# EAGLE design ALM (EAGLE 5.07)
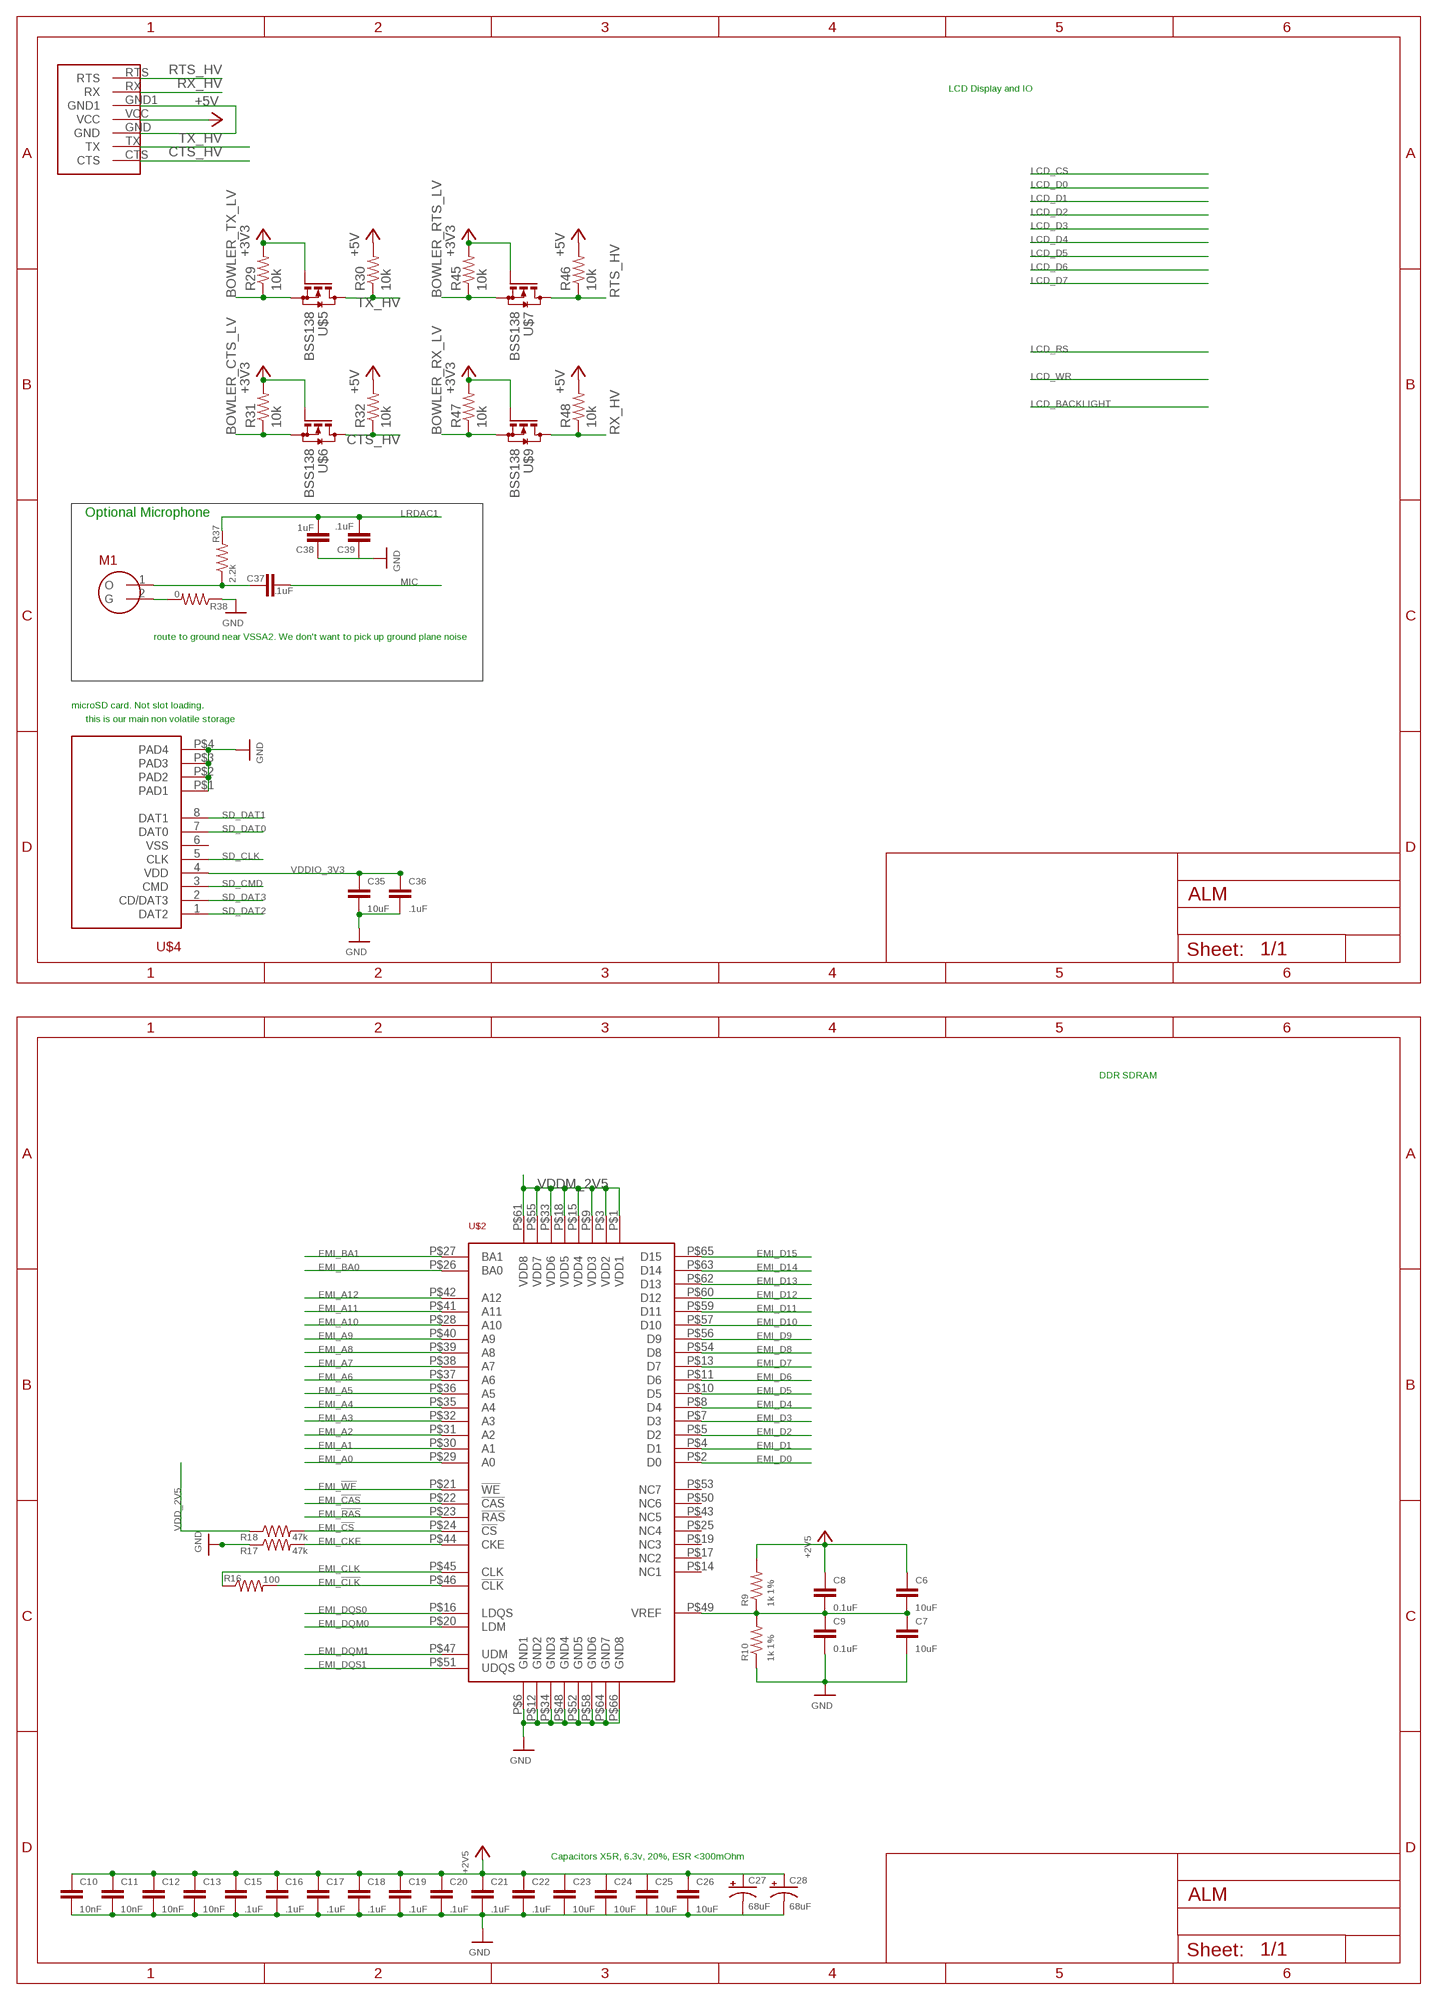
[diagram p0: schematic, sheet 1, part 1 of 3]
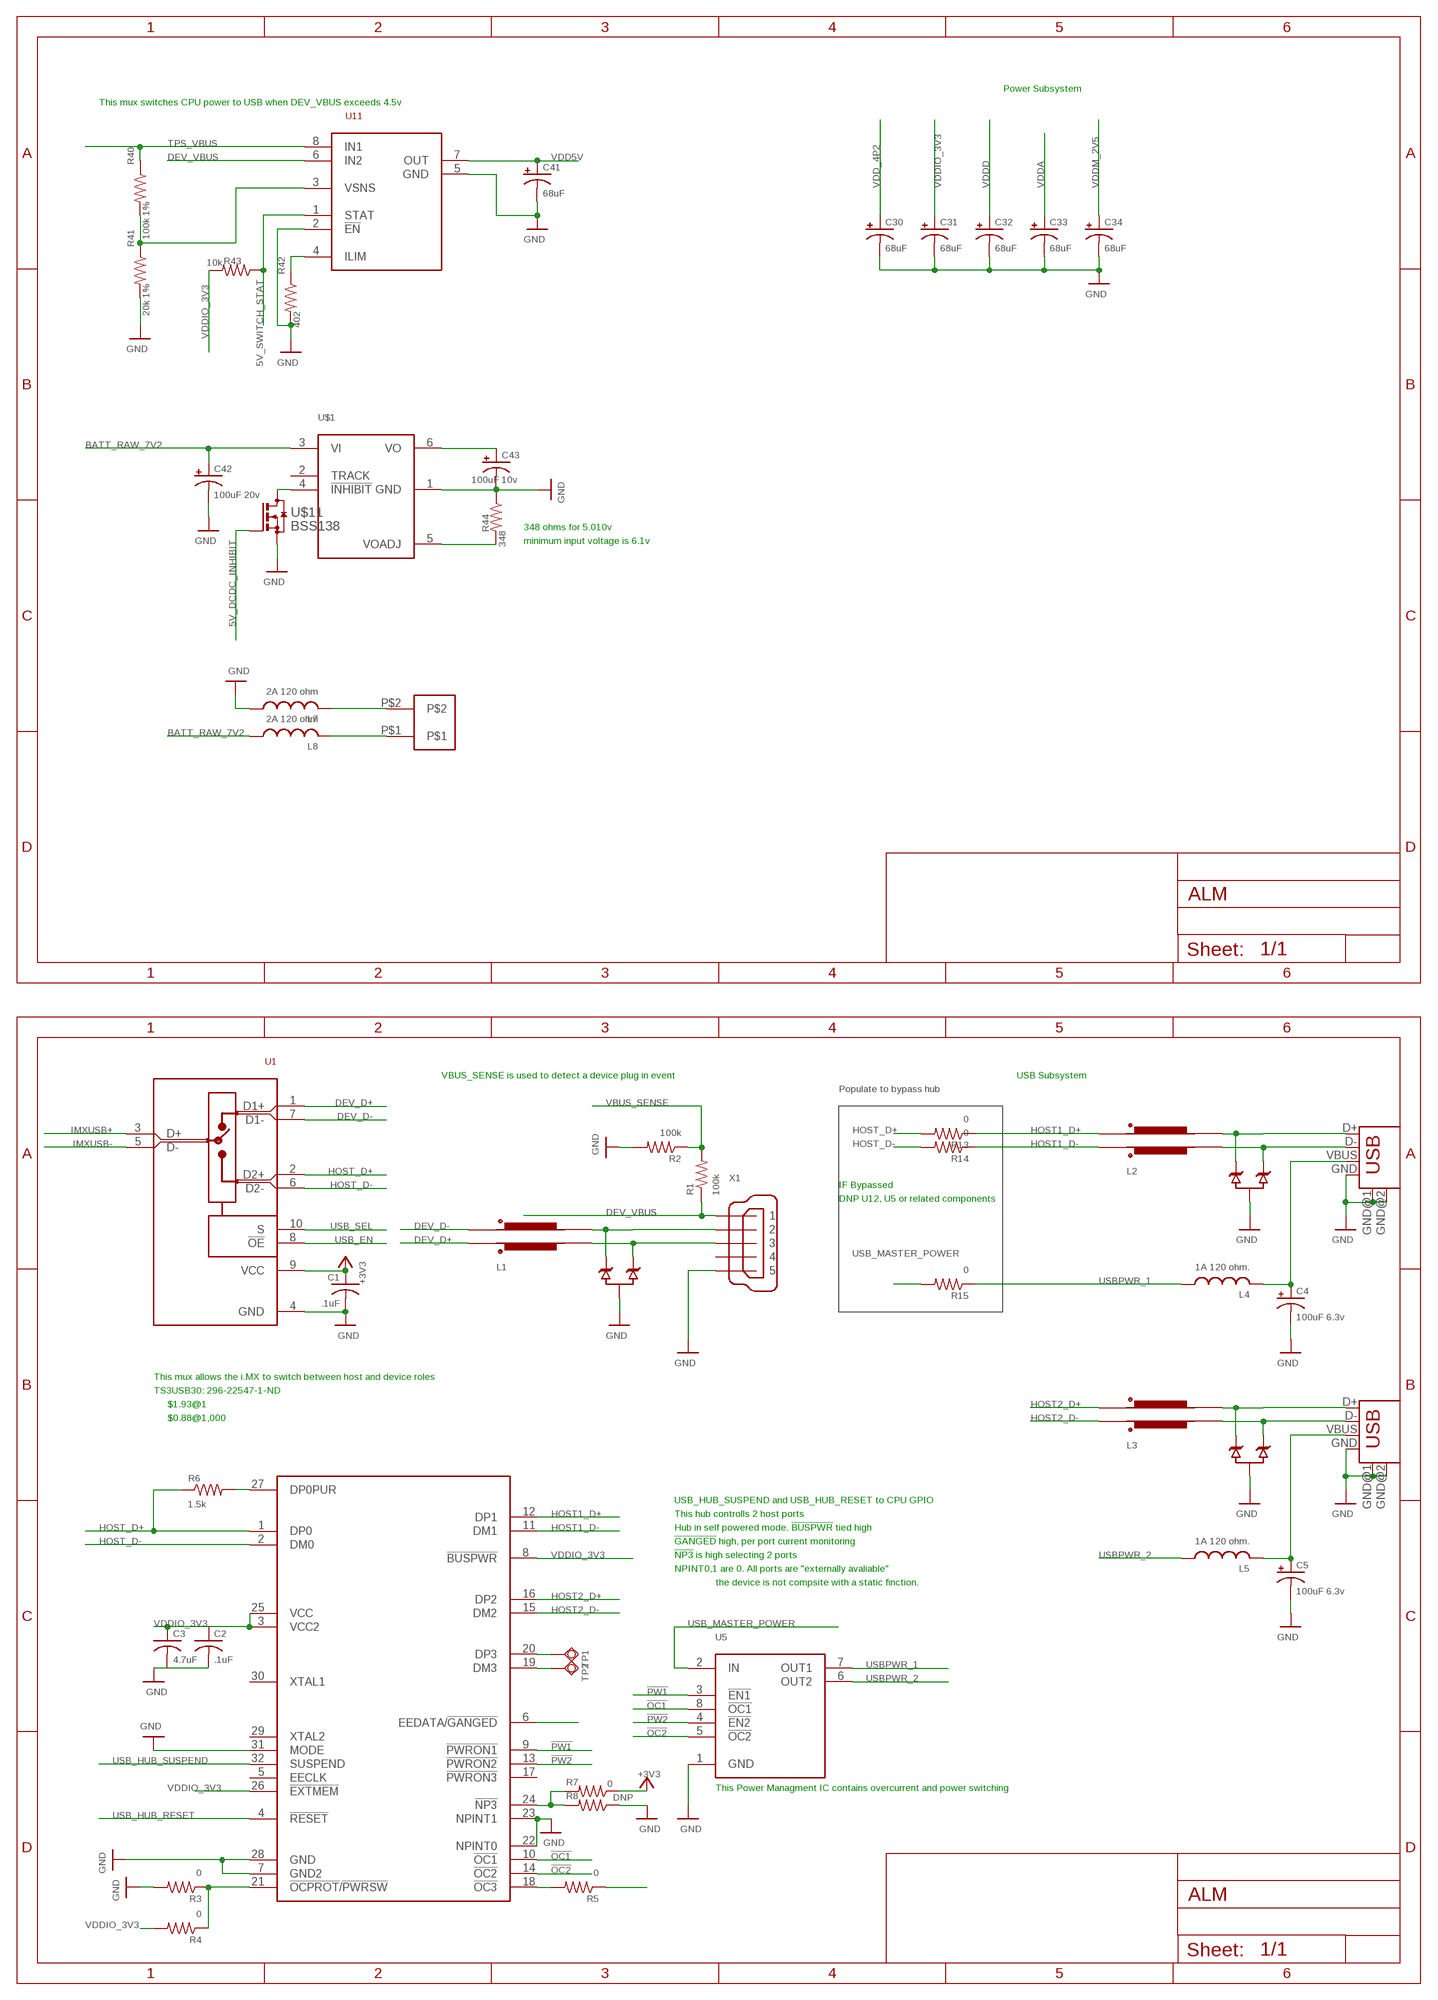
[diagram p1: schematic, sheet 1, part 2 of 3]
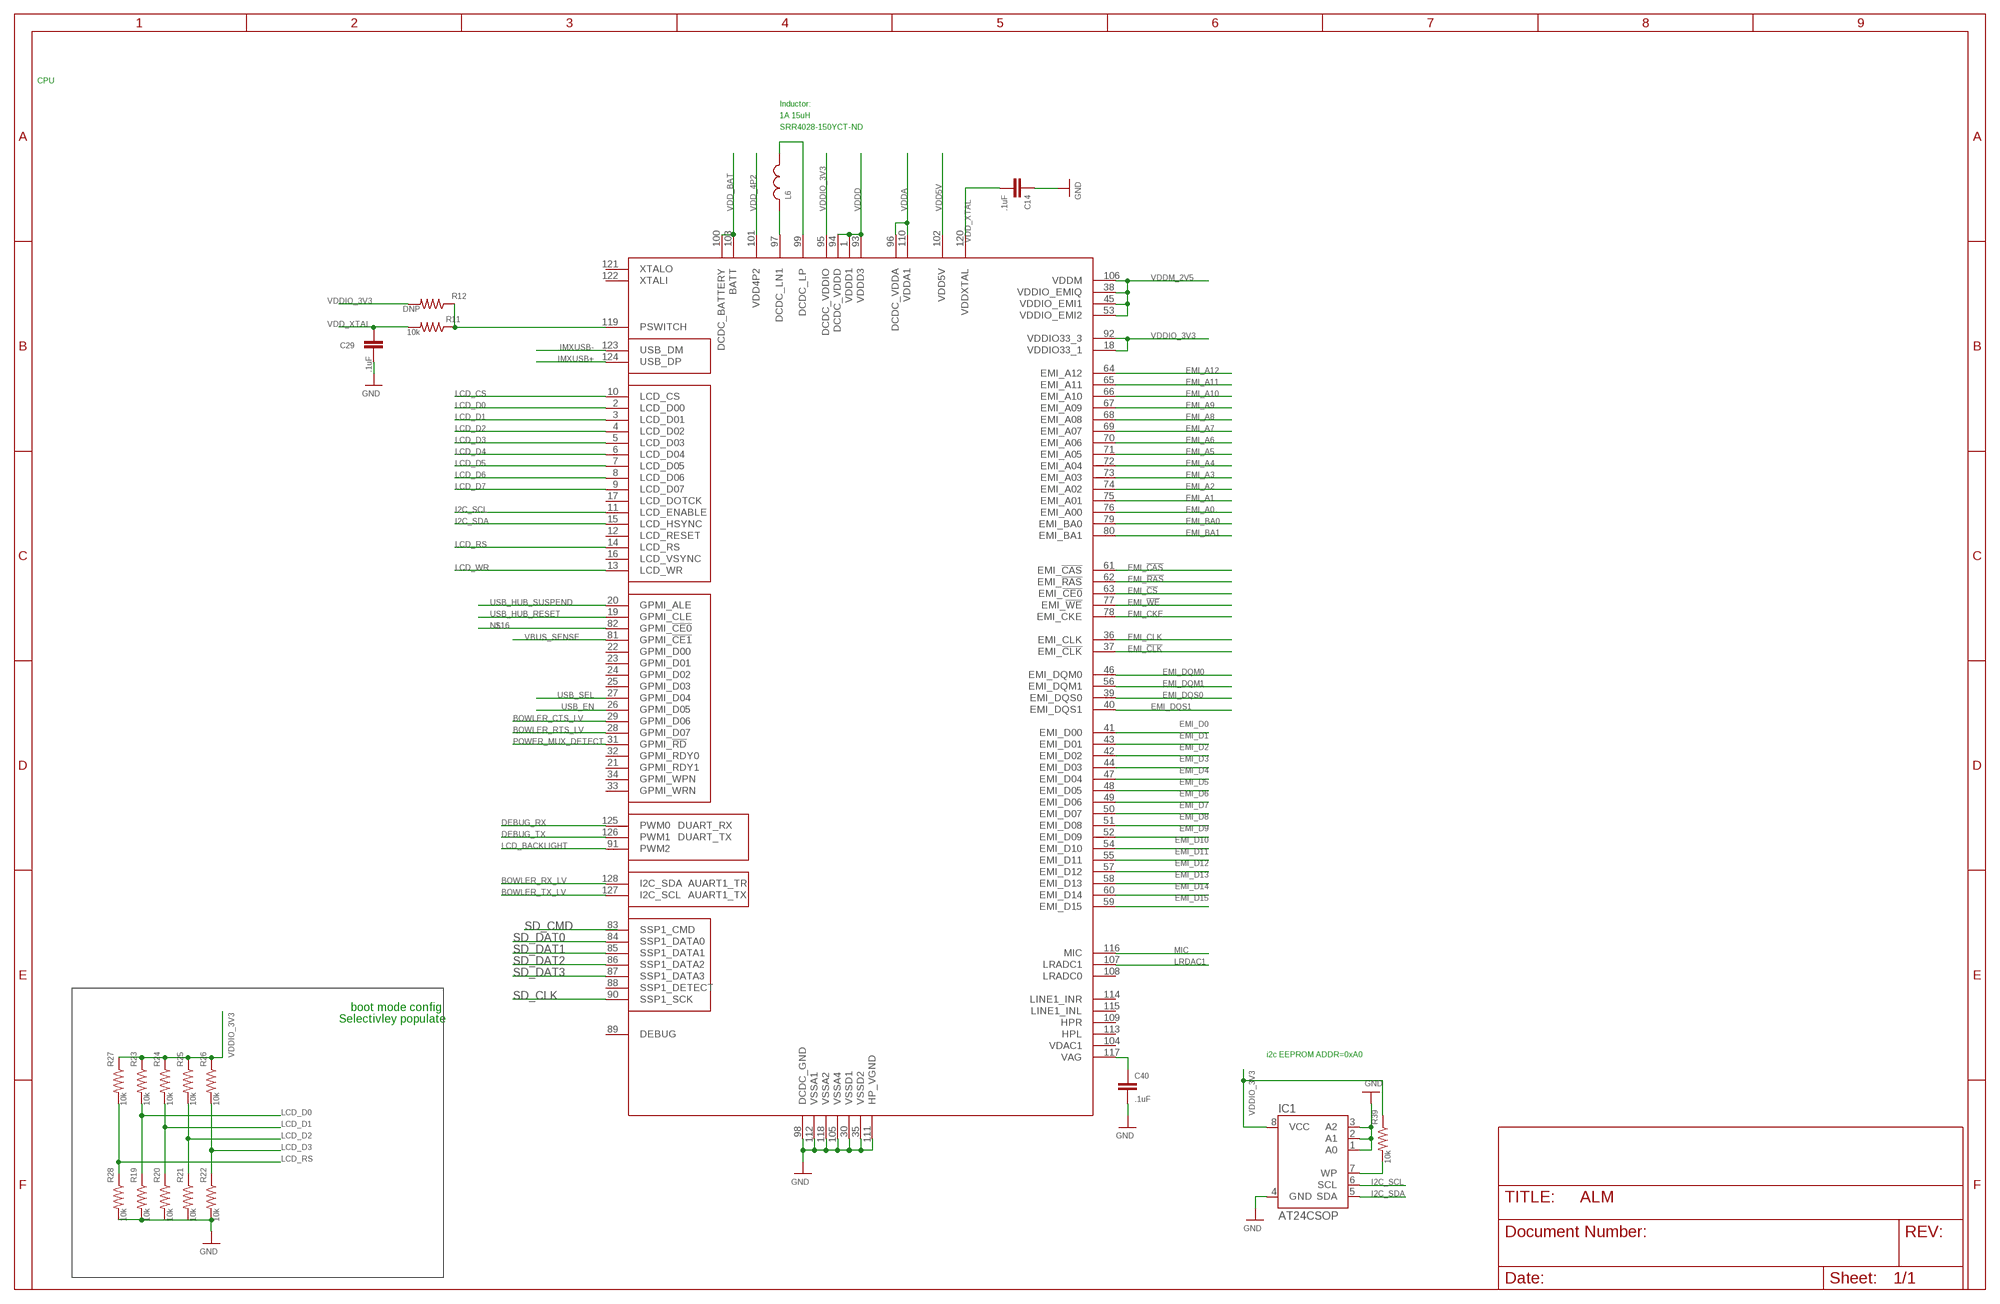
[diagram p2: schematic, sheet 1, part 3 of 3]

## Parts
C1  .1uF  C-USC0603  [C0603]
C2  .1uF  C-USC0603  [C0603]
C3  4.7uF  C-USC0603  [C0603]
C4  100uF 6.3v  CPOL-USE1.8-4  [E1,8-4]
C5  100uF 6.3v  CPOL-USE1.8-4  [E1,8-4]
C6  10uF  C-EUC0603  [C0603]
C7  10uF  C-EUC0603  [C0603]
C8  0.1uF  C-EUC0402  [C0402]
C9  0.1uF  C-EUC0402  [C0402]
C10  10nF  C-EUC0402  [C0402]
C11  10nF  C-EUC0402  [C0402]
C12  10nF  C-EUC0603  [C0603]
C13  10nF  C-EUC0402  [C0402]
C14  .1uF  C-EUC0402  [C0402]
C15  .1uF  C-EUC0402  [C0402]
C16  .1uF  C-EUC0402  [C0402]
C17  .1uF  C-EUC0402  [C0402]
C18  .1uF  C-EUC0402  [C0402]
C19  .1uF  C-EUC0402  [C0402]
C20  .1uF  C-EUC0402  [C0402]
C21  .1uF  C-EUC0402  [C0402]
C22  .1uF  C-EUC0402  [C0402]
C23  10uF  C-EUC0402  [C0402]
C24  10uF  C-EUC0402  [C0402]
C25  10uF  C-EUC0402  [C0402]
C26  10uF  C-EUC0402  [C0402]
C27  68uF  CPOL-US085CS-1AR  [085CS_1AR]
C28  68uF  CPOL-US085CS-1AR  [085CS_1AR]
C29  .1uF  C-EUC0402  [C0402]
C30  68uF  CPOL-US085CS-1AR  [085CS_1AR]
C31  68uF  CPOL-US085CS-1AR  [085CS_1AR]
C32  68uF  CPOL-US085CS-1AR  [085CS_1AR]
C33  68uF  CPOL-US085CS-1AR  [085CS_1AR]
C34  68uF  CPOL-US085CS-1AR  [085CS_1AR]
C35  10uF  C-EUC0402  [C0402]
C36  .1uF  C-EUC0402  [C0402]
C37  .1uF  C-EUC0402  [C0402]
C38  1uF  C-EUC0402  [C0402]
C39  .1uF  C-EUC0402  [C0402]
C40  .1uF  C-EUC0402  [C0402]
C41  68uF  CPOL-US085CS-1AR  [085CS_1AR]
C42  100uF 20v  CPOL-US085CS-1AR  [085CS_1AR]
C43  100uF 10v  CPOL-US085CS-1AR  [085CS_1AR]
IC1  AT24CSOP  [TSSOP8]
L1  FERITE_S0805  [SPLIT_0805]
L2  FERITE_S0805  [SPLIT_0805]
L3  FERITE_S0805  [SPLIT_0805]
L4  1A 120 ohm.  L-USL2825P  [L2825P]
L5  1A 120 ohm.  L-USL2825P  [L2825P]
L6  INDUCTOR  [SRR4028]
L7  2A 120 ohm  L-USL2825P  [L2825P]
L8  2A 120 ohm  L-USL2825P  [L2825P]
M1  CMA-4544PF-W  [CMA-4544PF-W]
R1  100k  R-US_R0603  [R0603]
R2  100k  R-US_R0603  [R0603]
R3  0  R-US_R0603  [R0603]
R4  0  R-US_R0603  [R0603]
R5  0  R-US_R0603  [R0603]
R6  1.5k  R-US_R0603  [R0603]
R7  0  R-US_R0603  [R0603]
R8  DNP  R-US_R0603  [R0603]
R9  1k 1%  R-US_R0402  [R0402]
R10  1k 1%  R-US_R0402  [R0402]
R11  10k  R-US_R0603  [R0603]
R12  DNP  R-US_R0603  [R0603]
R13  0  R-US_R0603  [R0603]
R14  0  R-US_R0603  [R0603]
R15  0  R-US_R0603  [R0603]
R16  100  R-US_R0603  [R0603]
R17  47k  R-US_R0603  [R0603]
R18  47k  R-US_R0603  [R0603]
R19  10k  R-US_R0603  [R0603]
R20  10k  R-US_R0603  [R0603]
R21  10k  R-US_R0603  [R0603]
R22  10k  R-US_R0603  [R0603]
R23  10k  R-US_R0603  [R0603]
R24  10k  R-US_R0603  [R0603]
R25  10k  R-US_R0603  [R0603]
R26  10k  R-US_R0603  [R0603]
R27  10k  R-US_R0603  [R0603]
R28  10k  R-US_R0603  [R0603]
R29  10k  R-US_R0603  [R0603]
R30  10k  R-US_R0603  [R0603]
R31  10k  R-US_R0603  [R0603]
R32  10k  R-US_R0603  [R0603]
R37  2.2k  R-US_R0402  [R0402]
R38  0  R-US_R0402  [R0402]
R39  10k  R-US_R0603  [R0603]
R40  100k 1%  R-US_R0603  [R0603]
R41  20k 1%  R-US_R0603  [R0603]
R42  402  R-US_R0603  [R0603]
R43  10k  R-US_R0603  [R0603]
R44  348  R-US_R0603  [R0603]
R45  10k  R-US_R0603  [R0603]
R46  10k  R-US_R0603  [R0603]
R47  10k  R-US_R0603  [R0603]
R48  10k  R-US_R0603  [R0603]
TP1  TPSQB1,27  [B1,27]
TP2  TPSQB1,27  [B1,27]
U1  TS3USB30E  [TQFP10]
U2  RCLAMP0502B  [SOT-523]
U3  RCLAMP0502B  [SOT-523]
U4  RCLAMP0502B  [SOT-523]
U5  TPS2042BDR  [SO08]
U11  TPS2113A  [TSSOP8]
U12  TUSB2036  [S-PQFP-G32]
U$1  PTH08000W  [PTH08000W]
U$2  DDR_SDRAM_X16  [66TSOP2]
U$3  IMX233TQFP  [14MM_128TQFP_E0.40]
U$4  101-00303  [AMPHENOL_USD]
U$5  BSS138  [SOT23]
U$6  BSS138  [SOT23]
U$7  BSS138  [SOT23]
U$9  BSS138  [SOT23]
U$10  WASP7PIN  [WASP7PIN]
U$11  BSS138  [SOT23]
U$12  2P  [2PTH]
USB1  USB-A-H  [USB-A-H]
USB2  USB-A-H  [USB-A-H]
X1  MINI-USB-SHIELD-UX60-MB-5S8  [UX60-MB-5S8]

## Nets
5V_DCDC_INHIBIT: U$11.1(G)
5V_SWITCH_STAT: R43.1 U11.1(STAT)
!OC1: U5.8(!OC1) U12.10(!OC1)
!OC2: U5.5(!OC2) U12.14(!OC2)
!PW1: U5.3(!EN1) U12.9(!PWRON1)
!PW2: U5.4(!EN2) U12.13(!PWRON2)
+3V3: C1.1 C6.1 C8.1 C10.1 C11.1 C12.1 C13.1 C15.1 C16.1 C17.1 C18.1 C19.1 C20.1 C21.1 C22.1 C26.1 C28.+ R7.1 R9.2 R29.2 R31.2 R45.2 R47.2 U1.9(VCC) U$5.1(G) U$6.1(G) U$7.1(G) U$9.1(G) ; supply symbol labelled +2V5
+5V: R30.2 R32.2 R46.2 R48.2 U$10.VCC
BATT_RAW_7V2: C42.+ L8.1 U$1.3(VI)
BOWLER_CTS_LV: R31.1 U$3.29(GPMI_D06) U$6.2(S)
BOWLER_RTS_LV: R45.1 U$3.28(GPMI_D07) U$7.2(S)
BOWLER_RX_LV: R47.1 U$3.128(I2C_SDA) U$9.2(S)
BOWLER_TX_LV: R29.1 U$3.127(I2C_SCL) U$5.2(S)
CTS_HV: R32.1 U$6.3(D) U$10.CTS
DCDC_LIN: L6.1 U$3.97(DCDC_LN1)
DCDC_LP: L6.2 U$3.99(DCDC_LP)
DEBUG_RX: U$3.125(PWM0)
DEBUG_TX: U$3.126(PWM1)
DEV_D+: L1.4 U1.1(D1+)
DEV_D+_UNFILTERED: X1.3
DEV_D-: L1.1 U1.7(D1-)
DEV_D-_UNFILTERED: L1.2 U2.2
DEV_VBUS: R1.1 U11.6(IN2) X1.1
EMI_!CAS: U$2.P$22(!CAS) U$3.61(EMI_!CAS)
EMI_!CLK: R16.2 U$2.P$46(!CLK) U$3.37(EMI_!CLK)
EMI_!CS: R18.2 U$2.P$24(!CS) U$3.63(EMI_!CE0)
EMI_!RAS: U$2.P$23(!RAS) U$3.62(EMI_!RAS)
EMI_!WE: U$2.P$21(!WE) U$3.77(EMI_!WE)
EMI_A0: U$2.P$29(A0) U$3.76(EMI_A00)
EMI_A1: U$2.P$30(A1) U$3.75(EMI_A01)
EMI_A2: U$2.P$31(A2) U$3.74(EMI_A02)
EMI_A3: U$2.P$32(A3) U$3.73(EMI_A03)
EMI_A4: U$2.P$35(A4) U$3.72(EMI_A04)
EMI_A5: U$2.P$36(A5) U$3.71(EMI_A05)
EMI_A6: U$2.P$37(A6) U$3.70(EMI_A06)
EMI_A7: U$2.P$38(A7) U$3.69(EMI_A07)
EMI_A8: U$2.P$39(A8) U$3.68(EMI_A08)
EMI_A9: U$2.P$40(A9) U$3.67(EMI_A09)
EMI_A10: U$2.P$28(A10) U$3.66(EMI_A10)
EMI_A11: U$2.P$41(A11) U$3.65(EMI_A11)
EMI_A12: U$2.P$42(A12) U$3.64(EMI_A12)
EMI_BA0: U$2.P$26(BA0) U$3.79(EMI_BA0)
EMI_BA1: U$2.P$27(BA1) U$3.80(EMI_BA1)
EMI_CKE: R17.2 U$2.P$44(CKE) U$3.78(EMI_CKE)
EMI_CLK: R16.1 U$2.P$45(CLK) U$3.36(EMI_CLK)
EMI_D0: U$2.P$2(D0) U$3.41(EMI_D00)
EMI_D1: U$2.P$4(D1) U$3.43(EMI_D01)
EMI_D2: U$2.P$5(D2) U$3.42(EMI_D02)
EMI_D3: U$2.P$7(D3) U$3.44(EMI_D03)
EMI_D4: U$2.P$8(D4) U$3.47(EMI_D04)
EMI_D5: U$2.P$10(D5) U$3.48(EMI_D05)
EMI_D6: U$2.P$11(D6) U$3.49(EMI_D06)
EMI_D7: U$2.P$13(D7) U$3.50(EMI_D07)
EMI_D8: U$2.P$54(D8) U$3.51(EMI_D08)
EMI_D9: U$2.P$56(D9) U$3.52(EMI_D09)
EMI_D10: U$2.P$57(D10) U$3.54(EMI_D10)
EMI_D11: U$2.P$59(D11) U$3.55(EMI_D11)
EMI_D12: U$2.P$60(D12) U$3.57(EMI_D12)
EMI_D13: U$2.P$62(D13) U$3.58(EMI_D13)
EMI_D14: U$2.P$63(D14) U$3.60(EMI_D14)
EMI_D15: U$2.P$65(D15) U$3.59(EMI_D15)
EMI_DQM0: U$2.P$20(LDM) U$3.46(EMI_DQM0)
EMI_DQM1: U$2.P$47(UDM) U$3.56(EMI_DQM1)
EMI_DQS0: U$2.P$16(LDQS) U$3.39(EMI_DQS0)
EMI_DQS1: U$2.P$51(UDQS) U$3.40(EMI_DQS1)
GND: C1.2 C2.2 C4.- C5.- C7.2 C9.2 C10.2 C11.2 C12.2 C13.2 C14.1 C15.2 C16.2 C17.2 C18.2 C19.2 C20.2 C21.2 C22.2 C26.2 C28.- C29.2 C30.- C31.- C32.- C33.- C34.- C35.2 C36.2 C38.1 C40.2 C41.- C42.- C43.- IC1.1(A0) IC1.2(A1) IC1.3(A2) IC1.4(GND) L7.1 R2.2 R3.2 R8.1 R10.1 R17.1 R19.2 R22.2 R28.2 R38.1 R41.2 R42.2 R44.1 U1.4(GND) U2.3 U3.3 U4.3 U5.1(GND) U11.2(!EN) U11.5(GND) U12.7(GND2) U12.22(NPINT0) U12.23(NPINT1) U12.28(GND) U12.31(MODE) U$1.1(GND) U$2.P$6(GND1) U$2.P$12(GND2) U$2.P$34(GND3) U$2.P$48(GND4) U$2.P$52(GND5) U$2.P$58(GND6) U$2.P$64(GND7) U$2.P$66(GND8) U$3.30(VSSD1) U$3.35(VSSD2) U$3.98(DCDC_GND) U$3.105(VSSA4) U$3.111(HP_VGND) U$3.112(VSSA1) U$3.118(VSSA2) U$4.P$1(PAD1) U$4.P$2(PAD2) U$4.P$3(PAD3) U$4.P$4(PAD4) U$10.GND U$10.GND1 U$11.2(S) USB1.GND USB1.GND@1(GND) USB1.GND@2(GND) USB2.GND USB2.GND@1(GND) USB2.GND@2(GND) X1.5
HOST1_D+: L2.1 R13.1
HOST1_D+_UNFILTERED: L2.2 U3.2 USB1.D+
HOST1_D-: L2.4 R14.1
HOST1_D-_UNFILTERED: L2.3 U3.1 USB1.D-
HOST2_D+: L3.1
HOST2_D+_UNFILTERED: USB2.D+
HOST2_D-: L3.4
HOST2_D-_UNFILTERED: L3.3 U4.1 USB2.D-
HOST_D+: R6.1 R13.2 U1.2(D2+) U12.1(DP0)
HOST_D-: R14.2 U1.6(D2-) U12.2(DM0)
I2C_SCL: IC1.6(SCL) U$3.11(LCD_ENABLE)
I2C_SDA: IC1.5(SDA) U$3.15(LCD_HSYNC)
IMXUSB+: U1.3(D+) U$3.124(USB_DP)
IMXUSB-: U1.5(D-) U$3.123(USB_DM)
LCD_BACKLIGHT: U$3.91(PWM2)
LCD_CS: U$3.10(LCD_CS)
LCD_D0: R19.1 R23.2 U$3.2(LCD_D00)
LCD_D1: R20.1 R24.2 U$3.3(LCD_D01)
LCD_D2: R21.1 R25.2 U$3.4(LCD_D02)
LCD_D3: R22.1 R26.2 U$3.5(LCD_D03)
LCD_D4: U$3.6(LCD_D04)
LCD_D5: U$3.7(LCD_D05)
LCD_D6: U$3.8(LCD_D06)
LCD_D7: U$3.9(LCD_D07)
LCD_RS: R27.2 R28.1 U$3.14(LCD_RS)
LCD_WR: U$3.13(LCD_WR)
LRDAC1: C38.2 C39.2 R37.2 U$3.107(LRADC1)
MIC: C37.2 U$3.116(MIC)
N$1: R3.1 R4.1 U12.21(!OCPROT!/!PWRSW)
N$2: L1.3 U2.1
N$3: R5.2 U12.18(!OC3)
N$4: X1.2
N$5: TP1.TP U12.20(DP3)
N$6: TP2.TP U12.19(DM3)
N$7: R6.2 U12.27(DP0PUR)
N$8: M1.2(G) R38.2
N$9: L3.2 U4.2
N$10: C4.+ L4.2 USB1.VBUS
N$11: R7.2 R8.2 U12.24(!NP3)
N$12: C5.+ L5.2 USB2.VBUS
N$13: R11.1 R12.1 U$3.119(PSWITCH)
N$14: C37.1 M1.1(O) R37.1
N$15: R5.1
N$16: U$3.82(GPMI_!CE0)
N$17: IC1.7(WP) R39.2
N$18: C40.1 U$3.117(VAG)
N$19: R42.1 U11.4(ILIM)
N$20: L8.2 U$12.P$1
N$21: R40.2 R41.1 U11.3(VSNS)
N$22: C43.+ U$1.6(VO)
N$23: L7.2 U$12.P$2
N$24: R44.2 U$1.5(VOADJ)
N$25: U$1.4(!INHIBIT) U$11.3(D)
N$29: C6.2 C7.1 C8.2 C9.1 R9.1 R10.2 U$2.P$49(VREF)
POWER_MUX_DETECT: U$3.31(GPMI_!RD)
RTS_HV: R46.1 U$7.3(D) U$10.RTS
RX_HV: R48.1 U$9.3(D) U$10.RX
TPS_VBUS: R40.1 U11.8(IN1)
TX_HV: R30.1 U$5.3(D) U$10.TX
USB_EN: U1.8(!OE) U$3.26(GPMI_D05)
USB_HUB_RESET: U12.4(!RESET) U$3.19(GPMI_CLE)
USB_HUB_SUSPEND: U12.32(SUSPEND) U$3.20(GPMI_ALE)
USB_MASTER_POWER: R15.2 U5.2(IN)
USB_SEL: U1.10(S) U$3.27(GPMI_D04)
USBPWR_1: L4.1 R15.1 U5.7(OUT1)
USBPWR_2: L5.1 U5.6(OUT2)
VBUS_SENSE: R1.2 R2.1 U$3.81(GPMI_!CE1)
VDD5V: C41.+ U11.7(OUT) U$3.102(VDD5V)
VDD_2V5: R18.1
VDD_4P2: C30.+ U$3.101(VDD4P2)
VDD_BAT: U$3.100(DCDC_BATTERY) U$3.103(BATT)
VDD_XTAL: C14.2 C29.1 R11.2 U$3.120(VDDXTAL)
VDDA: C33.+ U$3.96(DCDC_VDDA) U$3.110(VDDA1)
VDDD: C32.+ U$3.1(VDDD1) U$3.93(VDDD3) U$3.94(DCDC_VDDD)
VDDIO_3V3: C3.1 C31.+ C35.1 C36.1 IC1.8(VCC) R4.2 R12.2 R23.1 R24.1 R25.1 R26.1 R27.1 R39.1 R43.2 U12.3(VCC2) U12.6(EEDATA/!GANGED) U12.8(!BUSPWR) U12.25(VCC) U12.26(!EXTMEM) U$3.18(VDDIO33_1) U$3.92(VDDIO33_3) U$3.95(DCDC_VDDIO) U$4.4(VDD)
VDDM_2V5: U$2.P$1(VDD1) U$2.P$3(VDD2) U$2.P$9(VDD3) U$2.P$15(VDD4) U$2.P$18(VDD5) U$2.P$33(VDD6) U$2.P$55(VDD7) U$2.P$61(VDD8) U$3.38(VDDIO_EMIQ) U$3.45(VDDIO_EMI1) U$3.53(VDDIO_EMI2) U$3.106(VDDM)
Unconnected: C2.1 C3.2 C23.1 C23.2 C24.1 C24.2 C25.1 C25.2 C27.+ C27.- C34.+ C39.1 R20.2 R21.2 U12.5(EECLK) U12.11(DM1) U12.12(DP1) U12.15(DM2) U12.16(DP2) U12.17(!PWRON3) U12.29(XTAL2) U12.30(XTAL1) U$1.2(TRACK) U$2.P$14(NC1) U$2.P$17(NC2) U$2.P$19(NC3) U$2.P$25(NC4) U$2.P$43(NC5) U$2.P$50(NC6) U$2.P$53(NC7) U$3.12(LCD_RESET) U$3.16(LCD_VSYNC) U$3.17(LCD_DOTCK) U$3.21(GPMI_RDY1) U$3.22(GPMI_D00) U$3.23(GPMI_D01) U$3.24(GPMI_D02) U$3.25(GPMI_D03) U$3.32(GPMI_RDY0) U$3.33(GPMI_WRN) U$3.34(GPMI_WPN) U$3.83(SSP1_CMD) U$3.84(SSP1_DATA0) U$3.85(SSP1_DATA1) U$3.86(SSP1_DATA2) U$3.87(SSP1_DATA3) U$3.88(SSP1_DETECT) U$3.89(DEBUG) U$3.90(SSP1_SCK) U$3.104(VDAC1) U$3.108(LRADC0) U$3.109(HPR) U$3.113(HPL) U$3.114(LINE1_INR) U$3.115(LINE1_INL) U$3.121(XTALO) U$3.122(XTALI) U$4.1(DAT2) U$4.2(CD/DAT3) U$4.3(CMD) U$4.5(CLK) U$4.6(VSS) U$4.7(DAT0) U$4.8(DAT1) X1.4 X1.M1(S1) X1.M2(S2) X1.M3(S3) X1.M4(S4)

## Notes on the sheet
- LCD Display and IO | Power Subsystem | CPU
- This mux switches CPU power to USB when DEV_VBUS exceeds 4.5v
- Inductor:
- 1A 15uH
- SRR4028-150YCT-ND
- Optional Microphone
- 348 ohms for 5.010v
- minimum input voltage is 6.1v
- route to ground near VSSA2. We don't want to pick up ground plane noise
- microSD card. Not slot loading.
- this is our main non volatile storage
- DDR SDRAM | VBUS_SENSE is used to detect a device plug in event | USB Subsystem
- Populate to bypass hub
- IF Bypassed | boot mode config
- DNP U12, U5 or related components | Selectivley populate
- i2c EEPROM ADDR=0xA0
- This mux allows the i.MX to switch between host and device roles
- TS3USB30: 296-22547-1-ND
- $1.93@1
- $0.88@1,000
- USB_HUB_SUSPEND and USB_HUB_RESET to CPU GPIO
- This hub controlls 2 host ports
- Hub in self powered mode. !BUSPWR! tied high
- !GANGED! high, per port current monitoring
- !NP3! is high selecting 2 ports
- NPINT0,1 are 0. All ports are "externally avaliable"
- the device is not compsite with a static finction.
- This Power Managment IC contains overcurrent and power switching
- Capacitors X5R, 6.3v, 20%, ESR <300mOhm

## Library data of the parts
C1-C3 = rcl:C-US: CAPACITOR, American symbol
C4 C5 = rcl:CPOL-US: POLARIZED CAPACITOR, American symbol
C6-C26 C29 C35-C40 = rcl:C-EU: CAPACITOR, European symbol
C27 C28 C30-C34 C41-C43 = resistor:CPOL-US: POLARIZED CAPACITOR, American symbol
IC1 = at24cxx:AT24C*: 2-wire serial EEPROM
L1-L3 = ferrite_split_0805:FERITE_S0805
L4 L5 L7 L8 = rcl:L-US: INDUCTOR, American symbol
L6 = Inductor_SRR4028:INDUCTOR
M1 = CMA-4544PF-W:CMA-4544PF-W
R1-R32 R37-R48 = rcl:R-US_: RESISTOR, American symbol
TP1 TP2 = testpad:TPSQ: Test pad
U1 = TS3USB30:TS3USB30E
U2-U4 = rclamp0502b:RCLAMP0502B
U5 = TPS2042BDR:TPS2042BDR
U11 = tps2113a:TPS2113A
U12 = tusb2036:TUSB2036
U$1 = PTH0800W:PTH08000W
U$2 = DDR_SDRAM:DDR_SDRAM_X16
U$3 = imx233:IMX233TQFP
U$4 = amphenol_101-00303_usd:101-00303
U$5-U$7 U$9 U$11 = WASP:BSS138
U$10 = wasp7pin:WASP7PIN
U$12 = con_2h_70555-0001:2P
USB1 USB2 = con-usb-2:USB: USB Connectors
X1 = con-hirose:MINI-USB-SHIELD-: MINI USB Connector Source: http://www.hirose.co.jp/cataloge_hp/e24000019.pdf

## Board
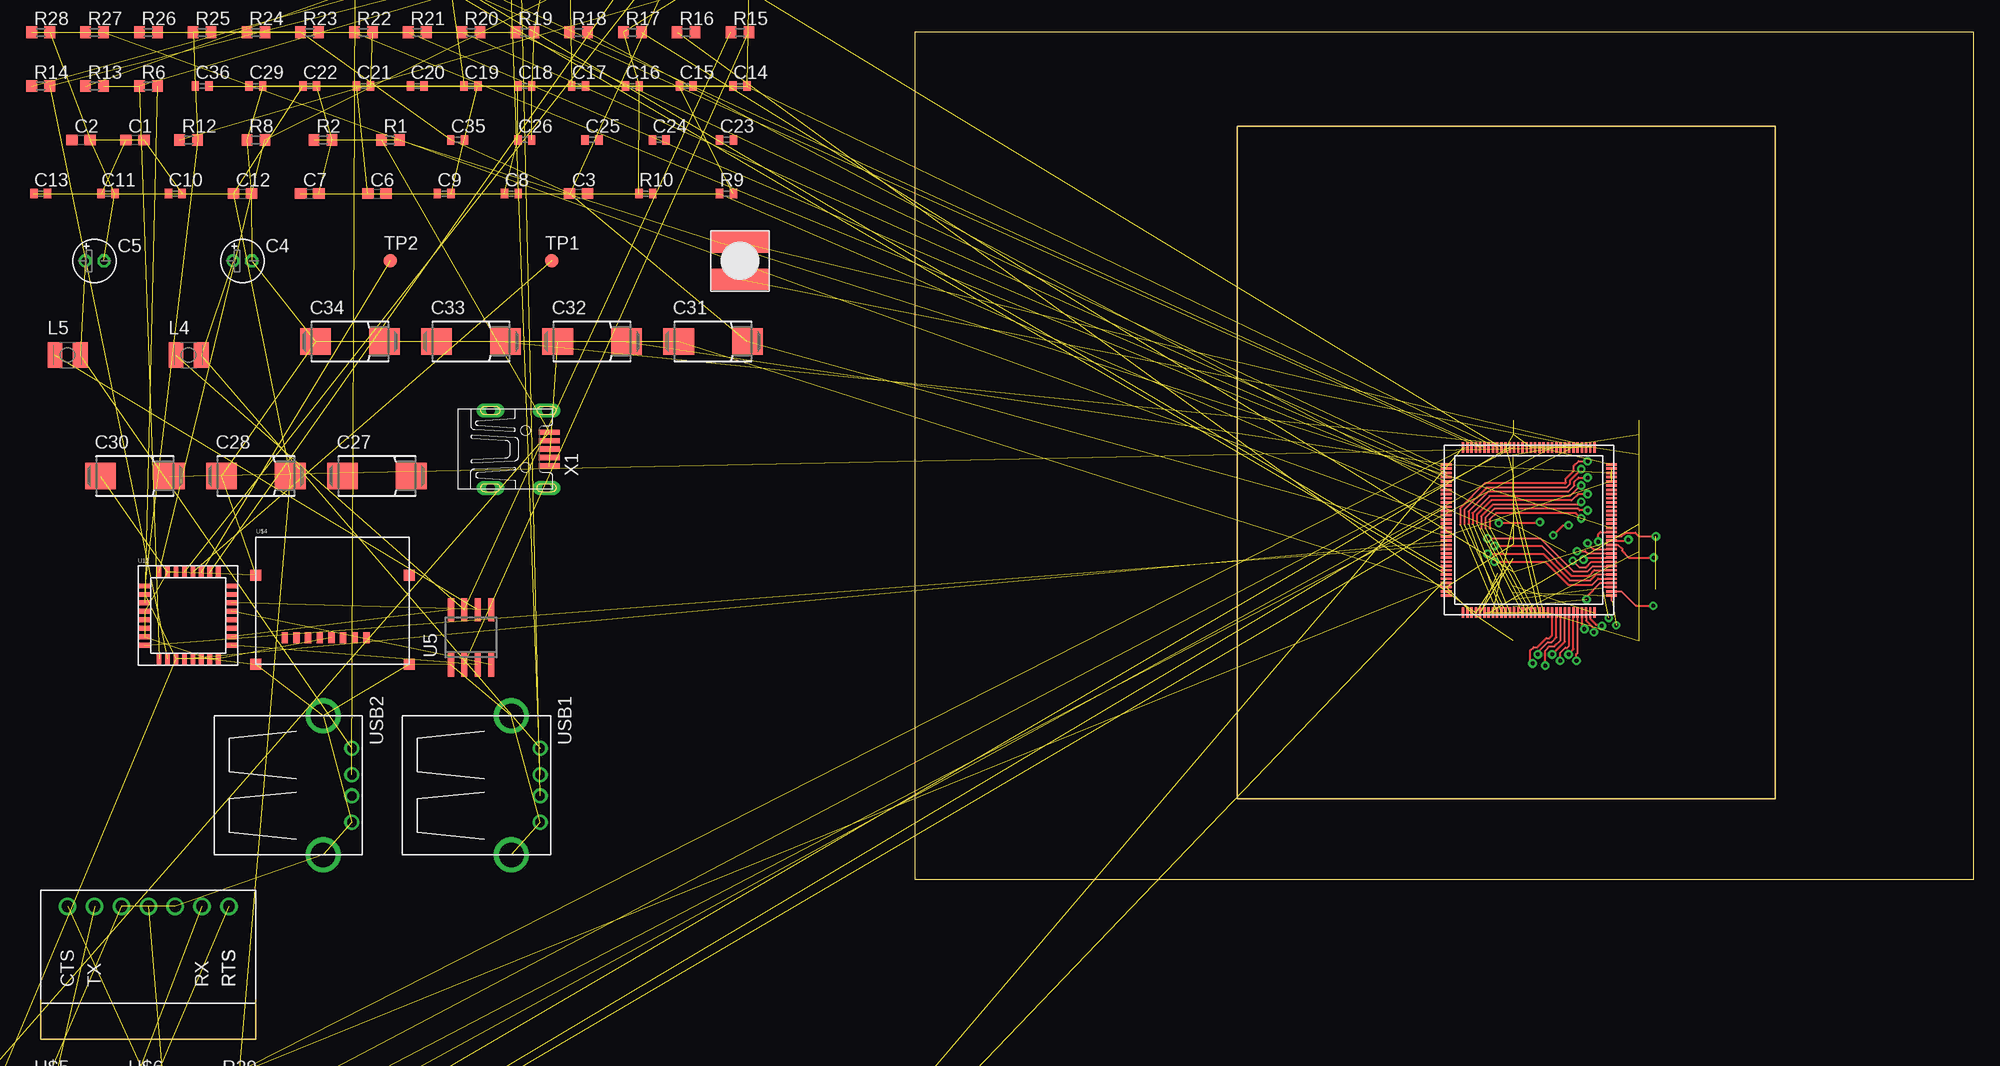
[diagram p3: board, top side]
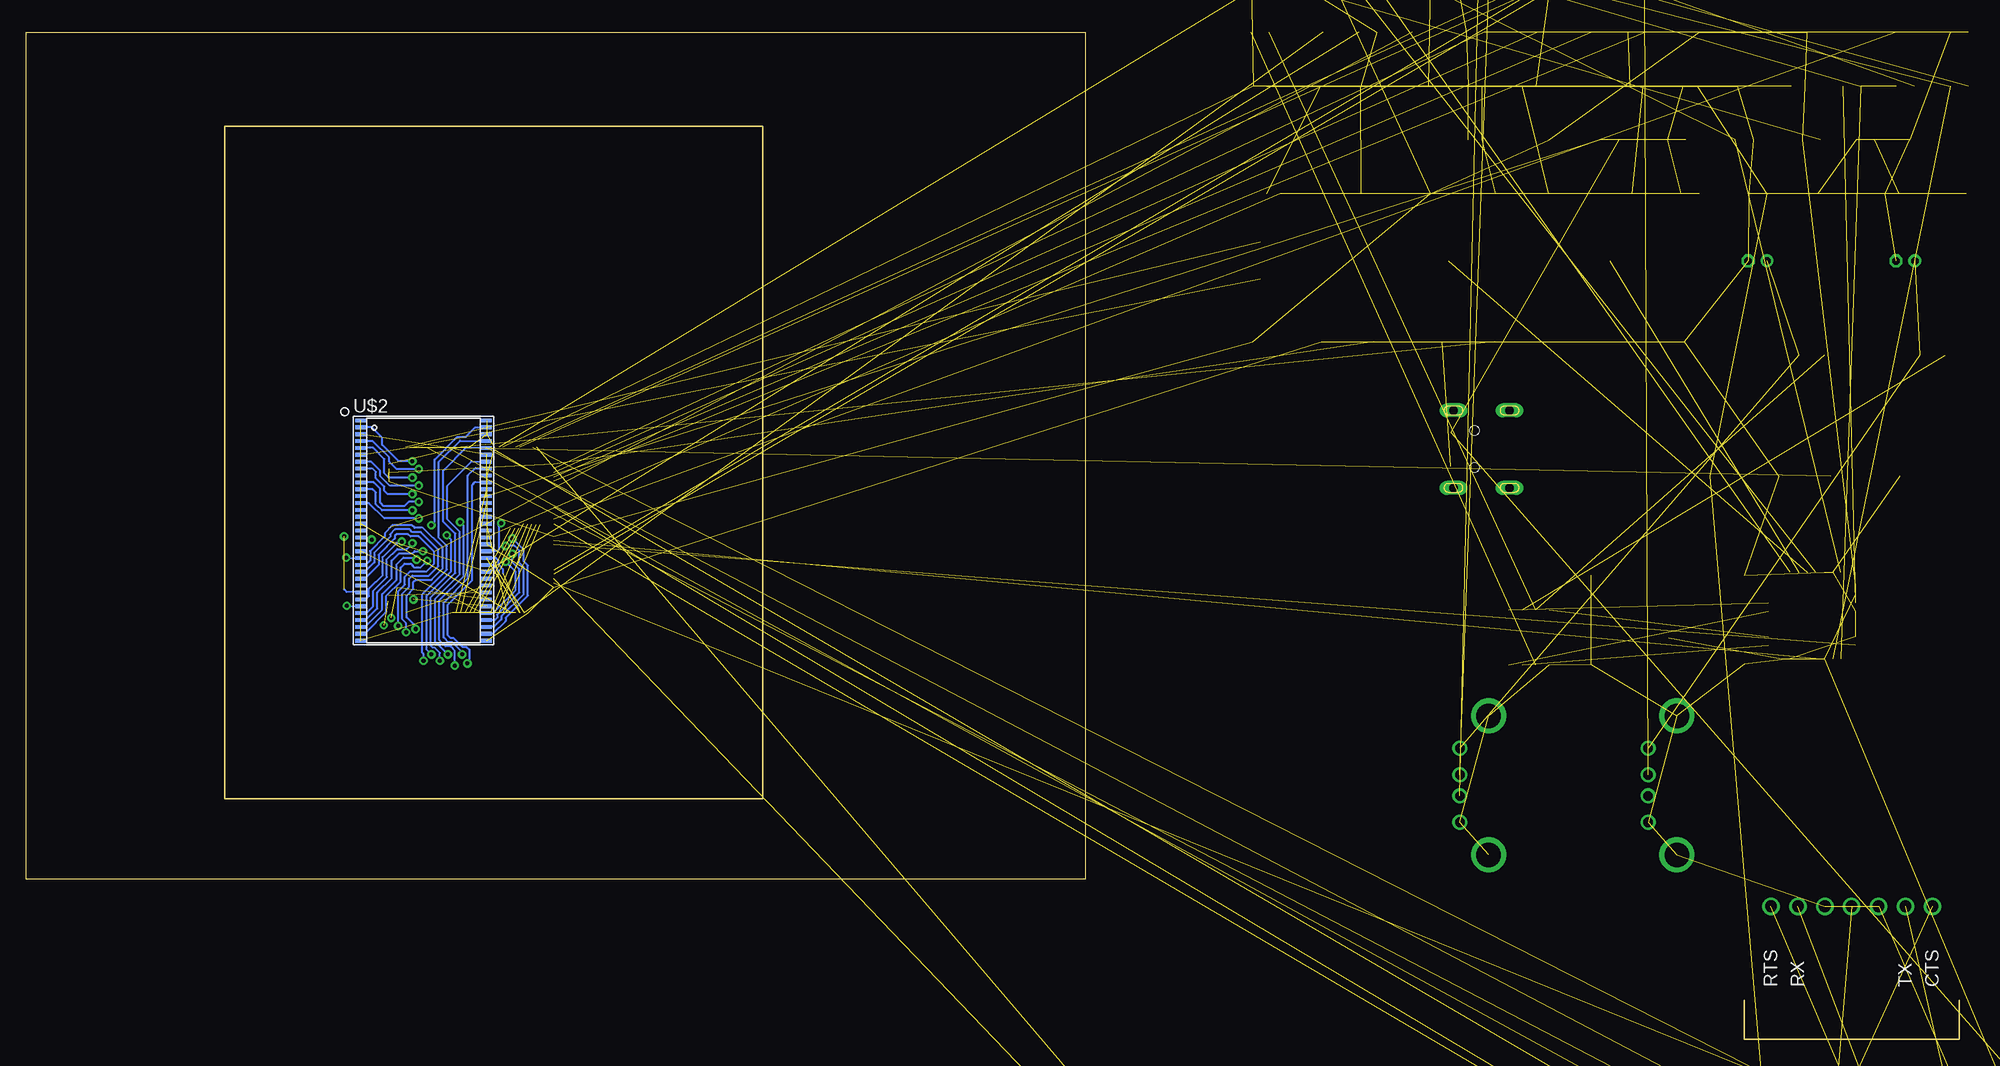
[diagram p4: board, bottom side, seen from below]

Size 100 x 80 mm. Coordinates in mm from the lower left corner, seen from the top.
Outline: 0,0 100,0 100,80 0,80 0,0
Copper layers (1*16): Top 0.035mm / dielectric 1.5mm / Bottom 0.035mm
Design rules "default *": minimum track width 6mil, minimum drill 15mil, track to track 6mil, track to pad 6mil, pad to pad 6mil, via to via 6mil, smd to smd 6mil, copper to edge 20mil, drill to drill 6mil, minimum pad ring 10mil, minimum via ring 8mil, stop-mask expansion 4mil, vias tented up to drill 0mil, thermal gap 10mil

### Footprints (pad centres in the part's own frame; a part is rotated, then mirrored left to right if it is on the bottom)
C0603 = smd 1.1 x 1: 1 -0.85,0; 2 0.85,0
E1,8-4 = drill 0.711 pad 1.168 round: + -0.889,0 | drill 0.711 pad 1.168 octagon: - 0.889,0
C0402 = smd 0.7 x 0.9: 1 -0.65,0; 2 0.65,0
085CS_1AR = smd 2.9 x 2.5: + 3.25,0; - -3.25,0
TSSOP8 = smd 0.35 x 1: 1 -0.975,-2.925; 2 -0.325,-2.925; 3 0.325,-2.925; 4 0.975,-2.925; 5 0.975,2.925; 6 0.325,2.925; 7 -0.325,2.925; 8 -0.975,2.925
SPLIT_0805 = smd 0.45 x 0.4: 1 0.225,-0.2; 2 1.775,-0.2; 3 1.775,-1; 4 0.225,-1
L2825P = smd 1.4 x 2.4: 1 -1.2,0; 2 1.2,0
SRR4028 = smd 5.3 x 2: 1 0,1.75; 2 0,-1.75
CMA-4544PF-W = drill 0.65 round: 1 2.5,0; 2 0,0
R0603 = smd 1 x 1.1: 1 -0.85,0; 2 0.85,0
R0402 = smd 0.7 x 0.9: 1 -0.65,0; 2 0.65,0
B1,27 = smd 1.27 x 1.27: TP 0,0
TQFP10 = smd 0.25 x 0.55: 1 -0.2,-1.175 | smd 0.25 x 0.45: 2 0.2,-1.225; 6 0.2,-0.225; 7 -0.2,-0.225 | smd 0.45 x 0.25: 3 0.7,-1.125; 4 0.7,-0.725; 5 0.7,-0.325; 8 -0.7,-0.325; 9 -0.7,-0.725; 10 -0.7,-1.125
SOT-523 = smd 0.4 x 0.8: 1 0,0; 2 1,0; 3 0.5,1.4
SO08 = smd 0.6 x 2.2: 1 -1.905,-2.6; 2 -0.635,-2.6; 3 0.635,-2.6; 4 1.905,-2.6; 5 1.905,2.6; 6 0.635,2.6; 7 -0.635,2.6; 8 -1.905,2.6
S-PQFP-G32 = smd 0.45 x 1: 1 -2.8,0.5; 2 -2,0.5; 3 -1.2,0.5; 4 -0.4,0.5; 5 0.4,0.5; 6 1.2,0.5; 7 2,0.5; 8 2.8,0.5; 17 2.8,8.7; 18 2,8.7; 19 1.2,8.7; 20 0.4,8.7; 21 -0.4,8.7; 22 -1.2,8.7; 23 -2,8.7; 24 -2.8,8.7 | smd 1 x 0.45: 9 4.05,1.8; 10 4.05,2.6; 11 4.05,3.4; 12 4.05,4.2; 13 4.05,5; 14 4.05,5.8; 15 4.05,6.6; 16 4.05,7.4; 25 -4.15,7.4; 26 -4.15,6.6; 27 -4.15,5.8; 28 -4.15,5; 29 -4.15,4.2; 30 -4.15,3.4; 31 -4.15,2.6; 32 -4.15,1.8
PTH08000W = drill 1.4 round: 1 0,9.525; 2 0,6.35; 3 0,3.175; 4 0,0; 5 15.875,0; 6 15.875,9.525
66TSOP2 = smd 0.35 x 1: P$1 0,0; P$2 -0.65,0; P$3 -1.3,0; P$4 -1.95,0; P$5 -2.6,0; P$6 -3.25,0; P$7 -3.9,0; P$8 -4.55,0; P$9 -5.2,0; P$10 -5.85,0; P$11 -6.5,0; P$12 -7.15,0; P$13 -7.8,0; P$14 -8.45,0; P$15 -9.1,0; P$16 -9.75,0; P$17 -10.4,0; P$18 -11.05,0; P$19 -11.7,0; P$20 -12.35,0; P$21 -13,0; P$22 -13.65,0; P$23 -14.3,0; P$24 -14.95,0; P$25 -15.6,0; P$26 -16.25,0; P$27 -16.9,0; P$28 -17.55,0; P$29 -18.2,0; P$30 -18.85,0; P$31 -19.5,0; P$32 -20.15,0; P$33 -20.8,0; P$34 -20.8,-11.91; P$35 -20.15,-11.91; P$36 -19.5,-11.91; P$37 -18.85,-11.91; P$38 -18.2,-11.91; P$39 -17.55,-11.91; P$40 -16.9,-11.91; P$41 -16.25,-11.91; P$42 -15.6,-11.91; P$43 -14.95,-11.91; P$44 -14.3,-11.91; P$45 -13.65,-11.91; P$46 -13,-11.91; P$47 -12.35,-11.91; P$48 -11.7,-11.91; P$49 -11.05,-11.91; P$50 -10.4,-11.91; P$51 -9.75,-11.91; P$52 -9.1,-11.91; P$53 -8.45,-11.91; P$54 -7.8,-11.91; P$55 -7.15,-11.91; P$56 -6.5,-11.91; P$57 -5.85,-11.91; P$58 -5.2,-11.91; P$59 -4.55,-11.91; P$60 -3.9,-11.91; P$61 -3.25,-11.91; P$62 -2.6,-11.91; P$63 -1.95,-11.91; P$64 -1.3,-11.91; P$65 -0.65,-11.91; P$66 0,-11.91
14MM_128TQFP_E0.40 = smd 1 x 0.23: 1 -0.8,-0.8; 2 -0.8,-1.2; 3 -0.8,-1.6; 4 -0.8,-2; 5 -0.8,-2.4; 6 -0.8,-2.8; 7 -0.8,-3.2; 8 -0.8,-3.6; 9 -0.8,-4; 10 -0.8,-4.4; 11 -0.8,-4.8; 12 -0.8,-5.2; 13 -0.8,-5.6; 14 -0.8,-6; 15 -0.8,-6.4; 16 -0.8,-6.8; 17 -0.8,-7.2; 18 -0.8,-7.6; 19 -0.8,-8; 20 -0.8,-8.4; 21 -0.8,-8.8; 22 -0.8,-9.2; 23 -0.8,-9.6; 24 -0.8,-10; 25 -0.8,-10.4; 26 -0.8,-10.8; 27 -0.8,-11.2; 28 -0.8,-11.6; 29 -0.8,-12; 30 -0.8,-12.4; 31 -0.8,-12.8; 32 -0.8,-13.2; 65 14.8,-13.2; 66 14.8,-12.8; 67 14.8,-12.4; 68 14.8,-12; 69 14.8,-11.6; 70 14.8,-11.2; 71 14.8,-10.8; 72 14.8,-10.4; 73 14.8,-10; 74 14.8,-9.6; 75 14.8,-9.2; 76 14.8,-8.8; 77 14.8,-8.4; 78 14.8,-8; 79 14.8,-7.6; 80 14.8,-7.2; 81 14.8,-6.8; 82 14.8,-6.4; 83 14.8,-6; 84 14.8,-5.6; 85 14.8,-5.2; 86 14.8,-4.8; 87 14.8,-4.4; 88 14.8,-4; 89 14.8,-3.6; 90 14.8,-3.2; 91 14.8,-2.8; 92 14.8,-2.4; 93 14.8,-2; 94 14.8,-1.6; 95 14.8,-1.2; 96 14.8,-0.8 | smd 0.23 x 1: 33 0.8,-14.8; 34 1.2,-14.8; 35 1.6,-14.8; 36 2,-14.8; 37 2.4,-14.8; 38 2.8,-14.8; 39 3.2,-14.8; 40 3.6,-14.8; 41 4,-14.8; 42 4.4,-14.8; 43 4.8,-14.8; 44 5.2,-14.8; 45 5.6,-14.8; 46 6,-14.8; 47 6.4,-14.8; 48 6.8,-14.8; 49 7.2,-14.8; 50 7.6,-14.8; 51 8,-14.8; 52 8.4,-14.8; 53 8.8,-14.8; 54 9.2,-14.8; 55 9.6,-14.8; 56 10,-14.8; 57 10.4,-14.8; 58 10.8,-14.8; 59 11.2,-14.8; 60 11.6,-14.8; 61 12,-14.8; 62 12.4,-14.8; 63 12.8,-14.8; 64 13.2,-14.8; 97 13.2,0.8; 98 12.8,0.8; 99 12.4,0.8; 100 12,0.8; 101 11.6,0.8; 102 11.2,0.8; 103 10.8,0.8; 104 10.4,0.8; 105 10,0.8; 106 9.6,0.8; 107 9.2,0.8; 108 8.8,0.8; 109 8.4,0.8; 110 8,0.8; 111 7.6,0.8; 112 7.2,0.8; 113 6.8,0.8; 114 6.4,0.8; 115 6,0.8; 116 5.6,0.8; 117 5.2,0.8; 118 4.8,0.8; 119 4.4,0.8; 120 4,0.8; 121 3.6,0.8; 122 3.2,0.8; 123 2.8,0.8; 124 2.4,0.8; 125 2,0.8; 126 1.6,0.8; 127 1.2,0.8; 128 0.8,0.8
AMPHENOL_USD = smd 0.6 x 1.05: 1 10.43,2.49; 2 9.33,2.49; 3 8.23,2.49; 4 7.13,2.49; 5 6.03,2.49; 6 4.93,2.49; 7 3.83,2.49; 8 2.73,2.49 | smd 1.05 x 1.05: P$1 0,0; P$2 14.5,0; P$3 0,8.4; P$4 14.5,8.4
SOT23 = smd 1 x 1.4: 1 -0.95,-1.1; 2 0.95,-1.1; 3 0,1.1
WASP7PIN = drill 1.1 round: CTS 0,0; GND 5.08,0; GND1 10.16,0; RTS 15.24,0; RX 12.7,0; TX 2.54,0; VCC 7.62,0
2PTH = drill 1.168 pad 1.93 round: P$1 -2.54,0; P$2 0,0
USB-A-H = drill 0.914 round: D+ 2.718,-1.003; D- 2.718,1.003; GND 2.718,-3.493; VBUS 2.718,3.493 | drill 2.311 round: GND@1 0,6.566; GND@2 0,-6.566
UX60-MB-5S8 = smd 2 x 0.5: 1 8.65,1.6; 2 8.65,0.8; 3 8.65,0; 4 8.65,-0.8; 5 8.65,-1.6 | drill 0.8 long: M1 3.1,-3.65; M2 3.1,3.65; M3 8.4,3.65; M4 8.4,-3.65 | hole 0.9: 6.4,-1.75; 6.4,1.75

### Placement (x,y rotation side)
C1  -73.66,69.85 0 top  (outside the outline)
C2  -78.74,69.85 0 top  (outside the outline)
C3  -31.75,64.77 0 top  (outside the outline)
C4  -63.5,58.42 0 top  (outside the outline)
C5  -77.47,58.42 0 top  (outside the outline)
C6  -50.8,64.77 0 top  (outside the outline)
C7  -57.15,64.77 0 top  (outside the outline)
C8  -38.1,64.77 0 top  (outside the outline)
C9  -44.45,64.77 0 top  (outside the outline)
C10  -69.85,64.77 0 top  (outside the outline)
C11  -76.2,64.77 0 top  (outside the outline)
C12  -63.5,64.77 0 top  (outside the outline)
C13  -82.55,64.77 0 top  (outside the outline)
C14  -16.51,74.93 0 top  (outside the outline)
C15  -21.59,74.93 0 top  (outside the outline)
C16  -26.67,74.93 0 top  (outside the outline)
C17  -31.75,74.93 0 top  (outside the outline)
C18  -36.83,74.93 0 top  (outside the outline)
C19  -41.91,74.93 0 top  (outside the outline)
C20  -46.99,74.93 0 top  (outside the outline)
C21  -52.07,74.93 0 top  (outside the outline)
C22  -57.15,74.93 0 top  (outside the outline)
C23  -17.78,69.85 0 top  (outside the outline)
C24  -24.13,69.85 0 top  (outside the outline)
C25  -30.48,69.85 0 top  (outside the outline)
C26  -36.83,69.85 0 top  (outside the outline)
C27  -50.8,38.1 0 top  (outside the outline)
C28  -62.23,38.1 0 top  (outside the outline)
C29  -62.23,74.93 0 top  (outside the outline)
C30  -73.66,38.1 0 top  (outside the outline)
C31  -19.05,50.8 0 top  (outside the outline)
C32  -30.48,50.8 0 top  (outside the outline)
C33  -41.91,50.8 0 top  (outside the outline)
C34  -53.34,50.8 0 top  (outside the outline)
C35  -43.18,69.85 0 top  (outside the outline)
C36  -67.31,74.93 0 top  (outside the outline)
C37  -93.98,-38.1 0 top  (outside the outline)
C38  -93.98,-53.34 0 top  (outside the outline)
C39  -93.98,-58.42 0 top  (outside the outline)
C40  -113.03,-58.42 0 top  (outside the outline)
C41  -121.92,-82.55 0 top  (outside the outline)
C42  -121.92,-110.49 0 top  (outside the outline)
C43  -121.92,-120.65 0 top  (outside the outline)
IC1  -100.33,-57.15 0 top  (outside the outline)
L1  -46.99,85.09 0 top  (outside the outline)
L2  -50.8,85.09 0 top  (outside the outline)
L3  -54.61,85.09 0 top  (outside the outline)
L4  -68.58,49.53 0 top  (outside the outline)
L5  -80.01,49.53 0 top  (outside the outline)
L6  -16.51,58.42 0 top  (outside the outline)
L7  -130.81,-138.43 0 top  (outside the outline)
L8  -130.81,-147.32 0 top  (outside the outline)
M1  -91.44,-29.21 0 top  (outside the outline)
R1  -49.53,69.85 0 top  (outside the outline)
R2  -55.88,69.85 0 top  (outside the outline)
R3  -20.32,85.09 0 top  (outside the outline)
R4  -24.13,85.09 0 top  (outside the outline)
R5  -27.94,85.09 0 top  (outside the outline)
R6  -72.39,74.93 0 top  (outside the outline)
R7  -31.75,85.09 0 top  (outside the outline)
R8  -62.23,69.85 0 top  (outside the outline)
R9  -17.78,64.77 0 top  (outside the outline)
R10  -25.4,64.77 0 top  (outside the outline)
R11  -16.51,85.09 0 top  (outside the outline)
R12  -68.58,69.85 0 top  (outside the outline)
R13  -77.47,74.93 0 top  (outside the outline)
R14  -82.55,74.93 0 top  (outside the outline)
R15  -16.51,80.01 0 top  (outside the outline)
R16  -21.59,80.01 0 top  (outside the outline)
R17  -26.67,80.01 0 top  (outside the outline)
R18  -31.75,80.01 0 top  (outside the outline)
R19  -36.83,80.01 0 top  (outside the outline)
R20  -41.91,80.01 0 top  (outside the outline)
R21  -46.99,80.01 0 top  (outside the outline)
R22  -52.07,80.01 0 top  (outside the outline)
R23  -57.15,80.01 0 top  (outside the outline)
R24  -62.23,80.01 0 top  (outside the outline)
R25  -67.31,80.01 0 top  (outside the outline)
R26  -72.39,80.01 0 top  (outside the outline)
R27  -77.47,80.01 0 top  (outside the outline)
R28  -82.55,80.01 0 top  (outside the outline)
R29  -64.77,-19.05 0 top  (outside the outline)
R30  -81.28,-27.94 0 top  (outside the outline)
R31  -76.2,-27.94 0 top  (outside the outline)
R32  -71.12,-27.94 0 top  (outside the outline)
R37  -93.98,-43.18 0 top  (outside the outline)
R38  -93.98,-48.26 0 top  (outside the outline)
R39  -107.95,-58.42 0 top  (outside the outline)
R40  -127,-58.42 0 top  (outside the outline)
R41  -127,-64.77 0 top  (outside the outline)
R42  -127,-69.85 0 top  (outside the outline)
R43  -127,-74.93 0 top  (outside the outline)
R44  -132.08,-121.92 0 top  (outside the outline)
R45  -131.95,-165.5 0 top  (outside the outline)
R46  -127,-165.5 0 top  (outside the outline)
R47  -132.4,-178.65 0 top  (outside the outline)
R48  -127.45,-178.65 0 top  (outside the outline)
TP1  -34.29,58.42 0 top  (outside the outline)
TP2  -49.53,58.42 0 top  (outside the outline)
U1  -43.18,85.09 0 top  (outside the outline)
U2  -35.56,83.82 0 top  (outside the outline)
U3  -38.1,83.82 0 top  (outside the outline)
U4  -40.64,83.82 0 top  (outside the outline)
U5  -41.91,22.86 0 top  (outside the outline)
U11  -119.38,-57.15 0 top  (outside the outline)
U12  -68.58,20.32 0 top  (outside the outline)
U$1  -124.46,-102.87 0 top  (outside the outline)
U$2  68.45,43.35 90 bottom
U$3  51,40 0 top
U$4  -62.23,20.32 0 top  (outside the outline)
U$5  -81.28,-20.32 0 top  (outside the outline)
U$6  -72.39,-20.32 0 top  (outside the outline)
U$7  -131.15,-158.9 0 top  (outside the outline)
U$8  [OUTLINE]  81.28,7.62 0 bottom
U$9  -131.6,-172.05 0 top  (outside the outline)
U$10  -80.01,-2.54 0 top  (outside the outline)
U$11  -130.81,-129.54 0 top  (outside the outline)
U$12  -129.54,-153.67 0 top  (outside the outline)
USB1  -38.1,8.89 0 top  (outside the outline)
USB2  -55.88,8.89 0 top  (outside the outline)
X1  -43.18,40.64 0 top  (outside the outline)

### Tracks (layer width: path | path; a pad name or v marks a point on that pad's centre or on a via)
5V_SWITCH_STAT  (1 unrouted)
!OC1  (1 unrouted)
!OC2  (1 unrouted)
!PW1  (1 unrouted)
!PW2  (1 unrouted)
+3V3  (27 unrouted)
+5V  (4 unrouted)
BATT_RAW_7V2  (2 unrouted)
BOWLER_CTS_LV  (2 unrouted)
BOWLER_RTS_LV  (2 unrouted)
BOWLER_RX_LV  (2 unrouted)
BOWLER_TX_LV  (2 unrouted)
CTS_HV  (2 unrouted)
DCDC_LIN  (1 unrouted)
DCDC_LP  (1 unrouted)
DEV_D+  (1 unrouted)
DEV_D-  (1 unrouted)
DEV_D-_UNFILTERED  (1 unrouted)
DEV_VBUS  (2 unrouted)
EMI_!CAS  (via drill 0.38)
  Top 0.2: U$3.61 63,23.9 v63.25,23.65
  Bottom 0.2: U$2.P$22 67.9,29.75 67.55,30.1 67.55,31 66.15,32.4 66.15,32.7 65.45,33.45 63.6,33.45 63.35,33.2 62.55,33.2 60.7,31.35 60.7,29.4 61.75,28.3 63.25,28.3 63.45,28.1 63.45,27.45 64.1,26.8 64.1,24.75 63.25,23.9 v63.25,23.65
EMI_!CLK  (2 unrouted)
  Bottom 0.2: U$2.P$46 55.65,30.35 55.4,30.1 55.4,29.7 55,29.3 55,28.9
EMI_!CS  (via drill 0.38)  (1 unrouted)
  Top 0.2: 63.8,24.75 U$3.63 63.8,24.6 64.35,24.05 64.8,24.05 v64.9,23.95
  Bottom 0.2: U$2.P$24 68.05,28.4 66.75,29.7 66.75,30.65 65.2,32.2 65.2,32.45 65.05,32.6 63.95,32.6 63.75,32.4 62.95,32.4 61.5,30.95 61.5,29.8 62.2,29.1 63.75,29.1 64.25,28.6 64.25,27.85 64.9,27.2 v64.9,23.95
EMI_!RAS  (via drill 0.38)
  Top 0.2: U$3.62 63.4,24.45 64.15,23.7 v64.15,23.35
  Bottom 0.2: U$2.P$23 68,29.1 67.15,29.95 67.15,30.85 65.65,32.35 65.65,32.6 65.2,33.05 63.8,33.05 63.55,32.8 62.75,32.8 61.1,31.15 61.1,29.6 62,28.7 63.55,28.7 63.85,28.4 63.85,27.65 64.5,27 64.5,24.55 64.15,24.2 v64.15,23.35
EMI_!WE  (via drill 0.38)
  Top 0.2: U$3.77 66.4,31.6 66.8,31.25 66.8,31.05 67.45,30.4 v69.8,30.4
  Bottom 0.2: 68.25,30.4 U$2.P$21 v69.8,30.4
EMI_A0  (via drill 0.38)
  Top 0.2: U$3.76 64.1,31.2 v63.55,31.75
  Bottom 0.2: v63.55,31.75 64.1,31.2 65,31.2 65.95,30.25 65.95,28.55 67.25,27.25 67.25,25.8 67.85,25.2 U$2.P$29
EMI_A1  (via drill 0.38)
  Top 0.2: U$3.75 63.55,30.8 63.35,31 v62.55,31
  Bottom 0.2: v62.55,31 63.35,31 63.55,30.8 64.8,30.8 65.5,30.1 65.5,28.45 66.85,27.1 66.85,25.6 67.9,24.55 U$2.P$30
EMI_A2  (via drill 0.38)
  Top 0.2: U$3.74 63.35,30.4 v63.15,30.2
  Bottom 0.2: v63.15,30.2 63.35,30.4 64.4,30.4 65.05,29.75 65.05,28.3 66.4,26.95 66.4,25.45 67.95,23.9 U$2.P$31
EMI_A3  (via drill 0.38)
  Top 0.2: U$3.73 63.9,30 63.4,29.5 62.75,29.5 v62.15,30.1
  Bottom 0.2: U$2.P$32 68,23.25 66,25.3 66,26.8 64.65,28.1 64.65,29.45 64.28,29.82 63.73,29.82 63.4,29.5 62.75,29.5 v62.15,30.1
EMI_A4  (via drill 0.38)
  Top 0.2: U$3.72 64.05,29.6 63.55,29.1 62.2,29.1 59.1,32.2 v54.1,32.2
  Bottom 0.2: U$2.P$35 55.95,23.2 54.75,24.4 54.75,24.7 52.65,26.8 52.65,29.65 53.05,30.05 53.05,31.15 v54.1,32.2
EMI_A5  (via drill 0.38 pad 0.41)
  Top 0.2: U$3.71 64.2,29.2 63.7,28.7 62,28.7 59.2,31.5 v54.75,31.5
  Bottom 0.2: U$2.P$36 55.85,23.85 55.15,24.55 55.15,24.85 53.05,26.95 53.05,29.5 53.45,29.9 53.45,31.05 53.9,31.5 v54.75,31.5
EMI_A6  (via drill 0.38 pad 0.41)
  Top 0.2: U$3.70 64.35,28.8 63.8,28.25 61.85,28.25 59.35,30.75 v54.1,30.75
  Bottom 0.2: U$2.P$37 55.75,24.5 55.55,24.7 55.55,25 53.45,27.1 53.45,29.3 54.1,29.95 v54.1,30.75
EMI_A7  (via drill 0.38 pad 0.41)
  Top 0.2: U$3.69 64.55,28.4 64,27.85 61.7,27.85 59.55,30 v54.75,30
  Bottom 0.2: v54.75,30 53.85,29.1 53.85,27.25 55.95,25.15 U$2.P$38
EMI_A8  (via drill 0.38 pad 0.41)  (1 unrouted)
  Top 0.2: U$3.68 64.75,28 63.45,26.7 v63.45,26.45
EMI_A9  (via drill 0.38 pad 0.41)  (2 unrouted)
  Top 0.2: U$3.67 65.05,27.6 65,27.55
  other vias: 65.55,24.7
EMI_A10  (via drill 0.38 pad 0.41)
  Top 0.2: U$3.66 66.75,27.2 68.1,25.85 v69.75,25.85
  Bottom 0.2: v69.75,25.85 U$2.P$28
EMI_A11  (via drill 0.38 pad 0.41)  (2 unrouted)
  Top 0.2: U$3.65 65.8,26.35 65.9,26.25
  other vias: 66.25,24
EMI_A12  (1 unrouted)
EMI_BA0  (via drill 0.38 pad 0.41)  (1 unrouted)
  Top 0.2: U$3.79 66.75,32.4 67.1,32.75 68.05,32.75 68.4,32.4 v70,32.4
  Bottom 0.2: U$2.P$26 69.75,27.15 70,27.4
EMI_BA1  (via drill 0.38 pad 0.41)
  Top 0.2: U$3.80 64.75,32.8 64.55,32.6 v64.55,31.9
  Bottom 0.2: v64.55,31.9 64.65,31.8 65,31.8 66.35,30.45 66.35,28.75 67.65,27.45 67.65,26.75 67.9,26.5 U$2.P$27
EMI_CKE  (via drill 0.38)  (2 unrouted)
  Top 0.2: U$3.78 67.3,32 v67.4,32.1
EMI_CLK  (2 unrouted)
  Bottom 0.2: U$2.P$45 55.95,29.7 55.4,29.15 55.4,28.9
EMI_D0  (via drill 0.38)  (1 unrouted)
  Top 0.2: v63.55,39.5 62.7,39.5 62.25,39.05 62.25,38.6 61.5,37.85 61.5,37.5 61.4,37.4 53.85,37.4 51.5,35.05 51.5,33.5
  Bottom 0.2: U$2.P$2 67.4,42.7 66.4,41.7 66.4,41.05 64.85,39.5 v63.55,39.5
EMI_D1  (via drill 0.38)  (1 unrouted)
  Top 0.2: v62.95,38.75 61.9,37.7 61.9,37.35 61.55,37 54,37 51.9,34.9 51.9,33.5
  Bottom 0.2: U$2.P$4 67.3,41.4 65.75,39.85 65.75,39.45 65.05,38.75 v62.95,38.75
EMI_D2  (via drill 0.38)  (1 unrouted)
  Top 0.2: v63.55,37.95 62.7,37.95 62.3,37.55 62.3,37.2 61.7,36.6 54.15,36.6 52.3,34.75 52.3,33.55
  Bottom 0.2: U$2.P$5 67.25,40.75 66.2,39.7 66.2,38.35 65.8,37.95 v63.55,37.95
EMI_D3  (via drill 0.38)  (1 unrouted)
  Top 0.2: v62.95,37.2 62.85,37.2 61.85,36.2 54.3,36.2 52.7,34.6 52.7,33.55
  Bottom 0.2: U$2.P$7 67.45,39.45 66.6,38.6 66.6,38.1 65.7,37.2 v62.95,37.2
EMI_D4  (via drill 0.38)  (1 unrouted)
  Top 0.2: v63.55,36.4 62.65,36.4 62.05,35.8 54.45,35.8 53.1,34.45 53.1,33.6
  Bottom 0.2: U$2.P$8 67.3,38.8 67,38.5 67,37.9 66.2,37.1 66.2,36.7 65.9,36.4 v63.55,36.4
EMI_D5  (via drill 0.38)  (1 unrouted)
  Top 0.2: v62.95,35.65 62.7,35.4 54.6,35.4 53.5,34.3 53.5,33.15
  Bottom 0.2: U$2.P$10 67.2,37.5 66.6,36.9 66.6,35.6 66.25,35.25 64.3,35.25 63.9,35.65 v62.95,35.65
EMI_D6  (via drill 0.38)  (1 unrouted)
  Top 0.2: v63.55,34.85 62.8,34.85 62.65,35 54.75,35 53.9,34.15 53.9,33.15
  Bottom 0.2: U$2.P$11 67.3,36.85 67,36.55 67,35.45 66.4,34.85 v63.55,34.85
EMI_D7  (via drill 0.38)  (1 unrouted)
  Top 0.2: v62.95,34.1 62.45,34.6 54.9,34.6 54.3,34 54.3,33.15
  Bottom 0.2: U$2.P$13 67.65,35.55 66.2,34.1 v62.95,34.1
EMI_D8  (1 unrouted)
EMI_D9  (1 unrouted)
EMI_D10  (via drill 0.38 pad 0.41)
  Top 0.2: U$3.54 60.2,23.05 59.95,22.8 59.65,22.8 58.8,21.95 58.45,21.95 58.15,21.65 58.15,20.6 v58.35,20.4
  Bottom 0.2: v58.35,20.4 58.15,20.6 58.15,21.65 58.45,21.95 58.8,21.95 59.65,22.8 59.95,22.8 60.2,23.05 60.2,25.95 57.9,28.25 57.9,37.25 57.6,37.55 U$2.P$57
EMI_D11  (via drill 0.38)
  Top 0.2: U$3.55 60.6,22.85 60.15,22.4 59.8,22.4 58.85,21.45 v58.85,21.25
  Bottom 0.2: U$2.P$59 57.6,38.85 58.3,38.15 58.3,28.45 60.6,26.15 60.6,22.85 60.15,22.4 59.8,22.4 58.85,21.45 v58.85,21.25
EMI_D12  (via drill 0.38)
  Top 0.2: U$3.57 61.4,22.45 v60.2,21.25
  Bottom 0.2: v60.2,21.25 61.4,22.45 61.4,26.5 59.1,28.8 59.1,32.85 60.25,34 60.25,37.2 57.95,39.5 U$2.P$60
EMI_D13  (via drill 0.38)
  Top 0.2: U$3.58 61.8,22.05 61.65,21.9 61.45,21.9 60.95,21.4 v60.95,20.65
  Bottom 0.2: v60.95,20.65 60.95,21.4 61.45,21.9 61.65,21.9 61.8,22.05 61.8,26.65 59.5,28.95 59.5,32.65 60.65,33.8 60.65,38.6 58.45,40.8 U$2.P$62
EMI_D14  (via drill 0.38)
  Top 0.2: U$3.60 62.6,21.4 62.5,21.3 v62.5,20.65
  Bottom 0.2: v62.5,20.65 62.5,21.3 62.6,21.4 62.6,26.95 60.3,29.25 60.3,31.5 61.05,32.25 61.05,39.45 59.05,41.45 U$2.P$63
EMI_D15  (via drill 0.38, 0.38 pad 0.41)
  Top 0.2: U$3.59 62.2,21.75 61.75,21.3 v61.75,21.25 | v60.3,32.5 61.25,33.45 v61.75,33.45
  Bottom 0.2: v61.75,21.25 62.2,21.7 62.2,26.8 59.9,29.1 59.9,32.1 v60.3,32.5 | v61.75,33.45 61.45,33.75 61.45,39.65 59.3,41.8 58.5,41.8 57.6,42.7 U$2.P$65
EMI_DQM0  (1 unrouted)
EMI_DQM1  (via drill 0.38, 0.38 pad 0.41)
  Top 0.2: U$3.56 61,22.6 60.4,22 59.95,22 59.55,21.6 v59.55,20.2 | v55.15,33.65 58.95,33.65 v59.05,33.75
  Bottom 0.2: v59.55,20.2 59.55,21.6 59.95,22 60.4,22 61,22.6 U$3.56 61,26.35 58.7,28.65 58.7,33.4 v59.05,33.75 | U$2.P$47 55.55,31 55.4,31.15 55.4,33.4 v55.15,33.65
EMI_DQS0  (1 unrouted)
EMI_DQS1  (1 unrouted)
GND  (92 unrouted)
HOST1_D+  (1 unrouted)
HOST1_D+_UNFILTERED  (2 unrouted)
HOST1_D-  (1 unrouted)
HOST1_D-_UNFILTERED  (2 unrouted)
HOST2_D-_UNFILTERED  (2 unrouted)
HOST_D+  (3 unrouted)
HOST_D-  (2 unrouted)
I2C_SCL  (1 unrouted)
I2C_SDA  (1 unrouted)
IMXUSB+  (1 unrouted)
IMXUSB-  (1 unrouted)
LCD_D0  (2 unrouted)
LCD_D1  (2 unrouted)
LCD_D2  (2 unrouted)
LCD_D3  (2 unrouted)
LCD_RS  (2 unrouted)
LRDAC1  (3 unrouted)
MIC  (1 unrouted)
N$1  (2 unrouted)
N$2  (1 unrouted)
N$3  (1 unrouted)
N$5  (1 unrouted)
N$6  (1 unrouted)
N$7  (1 unrouted)
N$8  (1 unrouted)
N$9  (1 unrouted)
N$10  (2 unrouted)
N$11  (2 unrouted)
N$12  (2 unrouted)
N$13  (2 unrouted)
N$14  (2 unrouted)
N$17  (1 unrouted)
N$18  (1 unrouted)
N$19  (1 unrouted)
N$20  (1 unrouted)
N$21  (2 unrouted)
N$22  (1 unrouted)
N$23  (1 unrouted)
N$24  (1 unrouted)
N$25  (1 unrouted)
N$29  (6 unrouted)
RTS_HV  (2 unrouted)
RX_HV  (2 unrouted)
TPS_VBUS  (1 unrouted)
TX_HV  (2 unrouted)
USB_EN  (1 unrouted)
USB_HUB_RESET  (1 unrouted)
USB_HUB_SUSPEND  (1 unrouted)
USB_MASTER_POWER  (1 unrouted)
USB_SEL  (1 unrouted)
USBPWR_1  (2 unrouted)
USBPWR_2  (1 unrouted)
VBUS_SENSE  (2 unrouted)
VDD5V  (2 unrouted)
VDD_4P2  (1 unrouted)
VDD_BAT  (1 unrouted)
VDD_XTAL  (3 unrouted)
VDDA  (2 unrouted)
VDDD  (3 unrouted)
VDDIO_3V3  (22 unrouted)
VDDM_2V5  (11 unrouted)